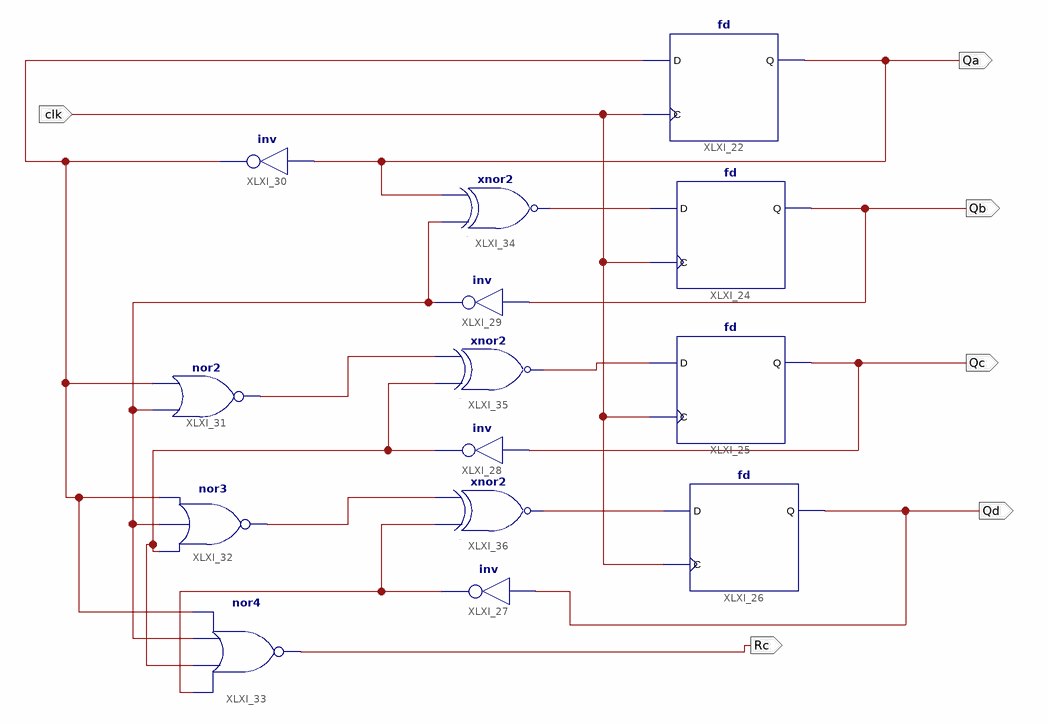
[diagram p0: schematic sheet 1]
// Xilinx ISE schematic Counter_4bit.sch (kintex7) as structural Verilog: 14 symbols, 6 ports
module Counter_4bit (
  input  clk,
  output Qa,
  output Qb,
  output Qc,
  output Qd,
  output Rc
);

  wire XLXN_61, XLXN_65, XLXN_67, XLXN_70, XLXN_71, XLXN_73, XLXN_74, XLXN_75, XLXN_78;

  fd XLXI_22 (.C(clk), .D(XLXN_61), .Q(Qa));
  fd XLXI_24 (.C(clk), .D(XLXN_65), .Q(Qb));
  fd XLXI_25 (.C(clk), .D(XLXN_71), .Q(Qc));
  fd XLXI_26 (.C(clk), .D(XLXN_74), .Q(Qd));
  not XLXI_27 (XLXN_78, Qd);
  not XLXI_28 (XLXN_73, Qc);
  not XLXI_29 (XLXN_67, Qb);
  not XLXI_30 (XLXN_61, Qa);
  nor XLXI_31 (XLXN_70, XLXN_67, XLXN_61);
  nor XLXI_32 (XLXN_75, XLXN_73, XLXN_67, XLXN_61);
  nor XLXI_33 (Rc, XLXN_78, XLXN_73, XLXN_67, XLXN_61);
  xnor XLXI_34 (XLXN_65, XLXN_67, Qa);
  xnor XLXI_35 (XLXN_71, XLXN_73, XLXN_70);
  xnor XLXI_36 (XLXN_74, XLXN_78, XLXN_75);
endmodule
